# EAGLE design Adapter-IO4-35mm (EAGLE 7.7.0)
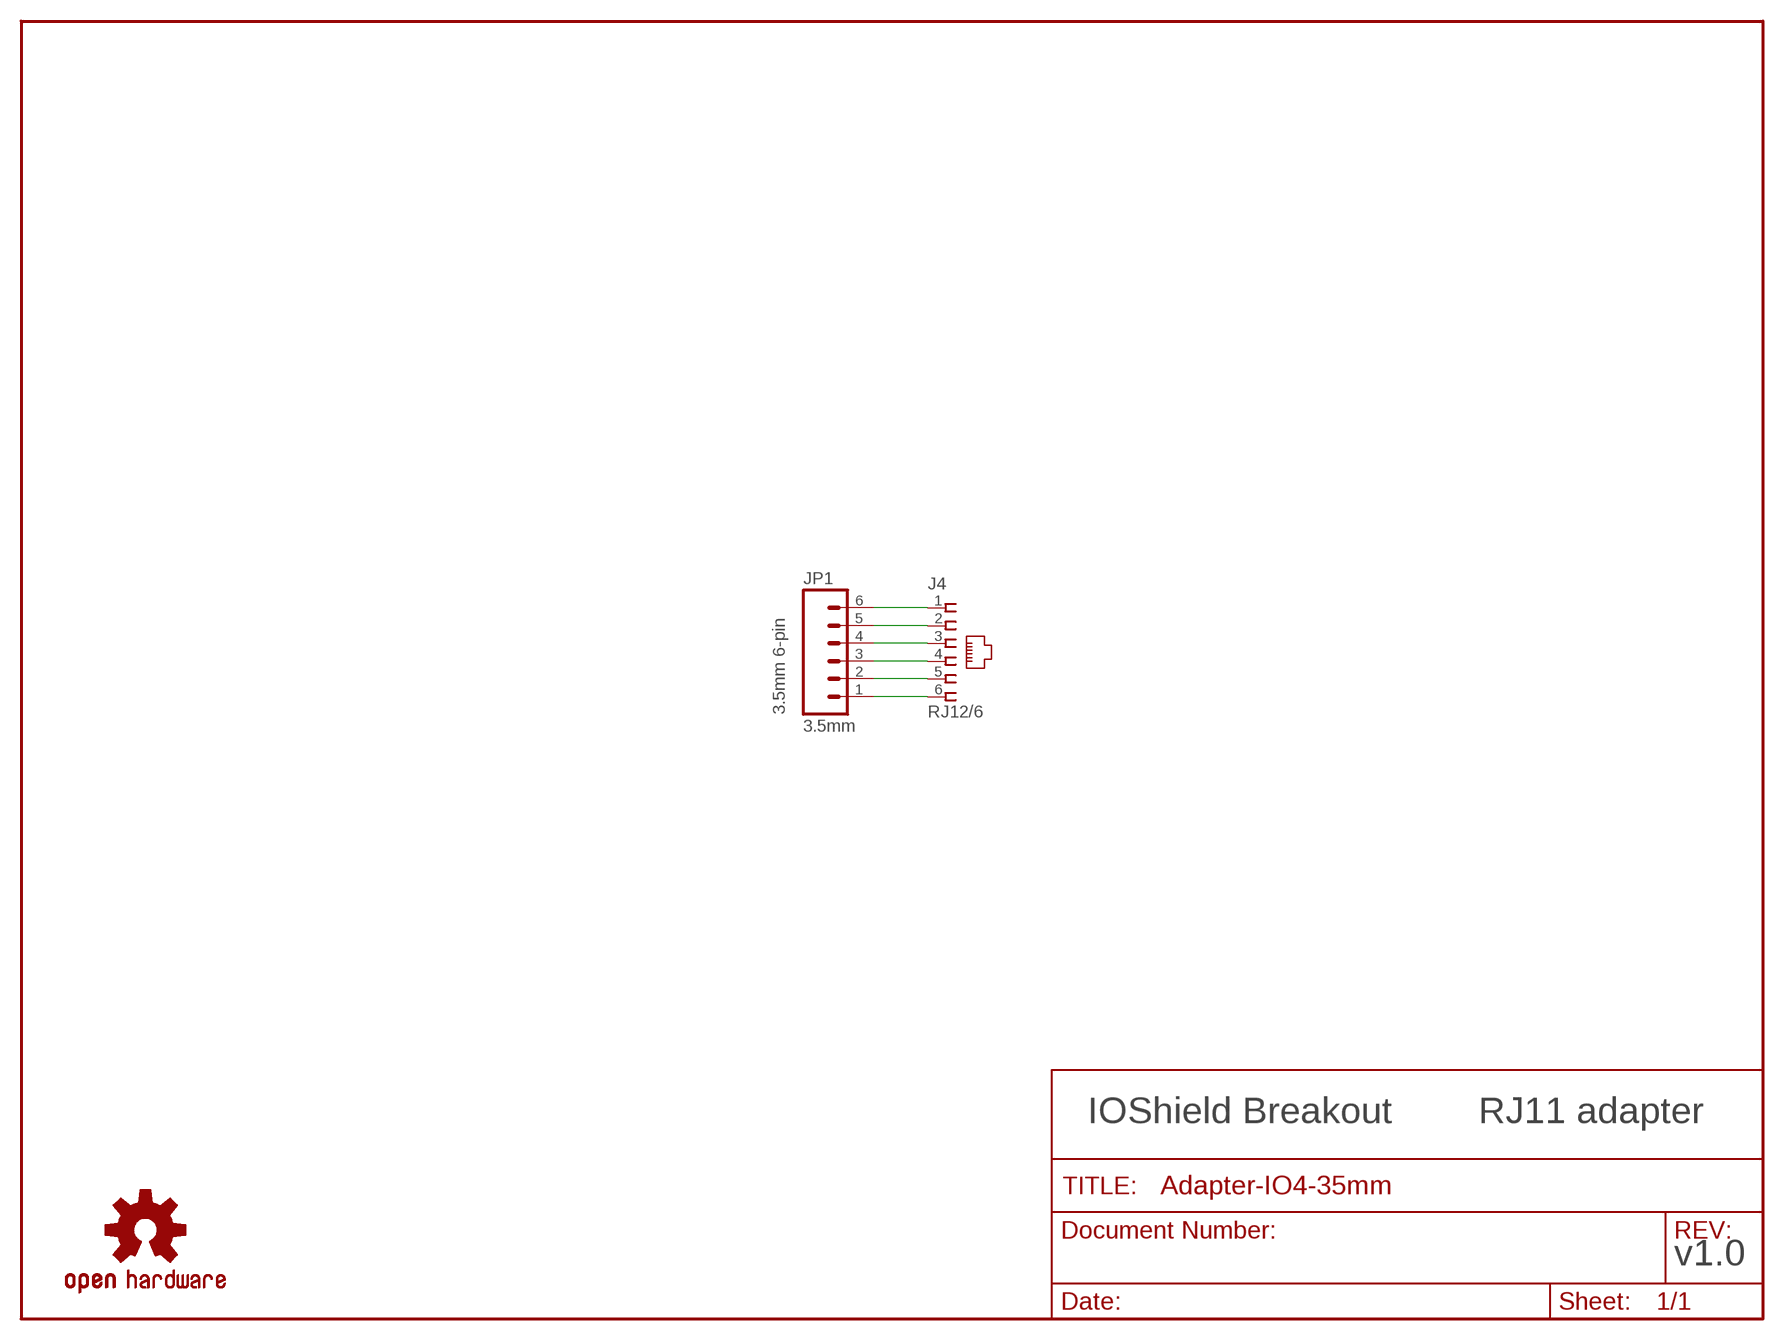
[diagram p0: schematic, sheet 1]

## Parts
J4  RJ12/6  CONNECTOR-RJ25-6P6C  [RJ25-PANEL]
JP1  3.5mm  CONNECTOR-M063.5MM-6  [SCREWTERMINAL-3.5MM-6]
U$1  OSHW  DOC-OSHW-LOGO-M  [OSHW-LOGO-M]

## Nets
GND: J4.6 JP1.1
IO1: J4.2 JP1.5
IO2: J4.3 JP1.4
IO3: J4.4 JP1.3
IO4: J4.5 JP1.2
VCC: J4.1 JP1.6

## Notes on the sheet
- 3.5mm 6-pin
- IOShield Breakout | RJ11 adapter
- v1.0

## Library data of the parts
J4 = SPCoast:CONNECTOR-RJ25: AMP connector; AMP: 520250-3; OPL: none
JP1 = SPCoast:CONNECTOR-M06: Header 6 Standard 6-pin 0.1" header
U$1 = SPCoast:DOC-OSHW-LOGO-: Open Source Hardware Logo This logo indicates the piece of hardware it is found on incorporates a OSHW license and/or adheres to the definition of open source hardware http://freedomdefined.org/OSHW Creative Commons - Attribution - ShareAlike 3.0

## Net classes
0 default: width 0.508 mm

## Board
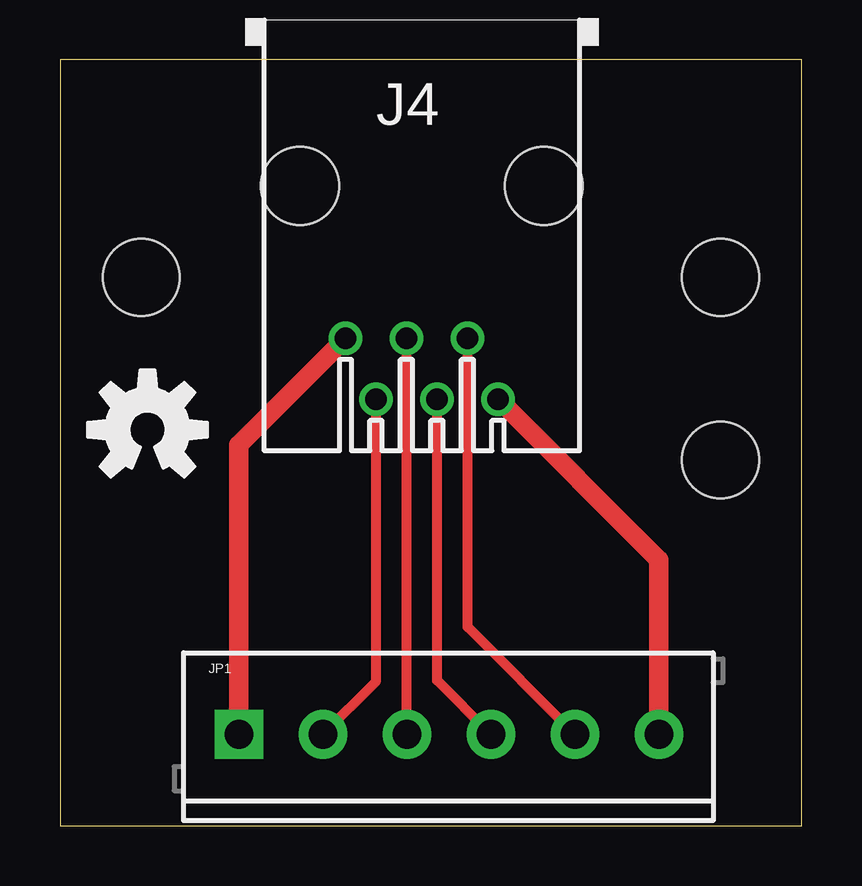
[diagram p1: board, top side]
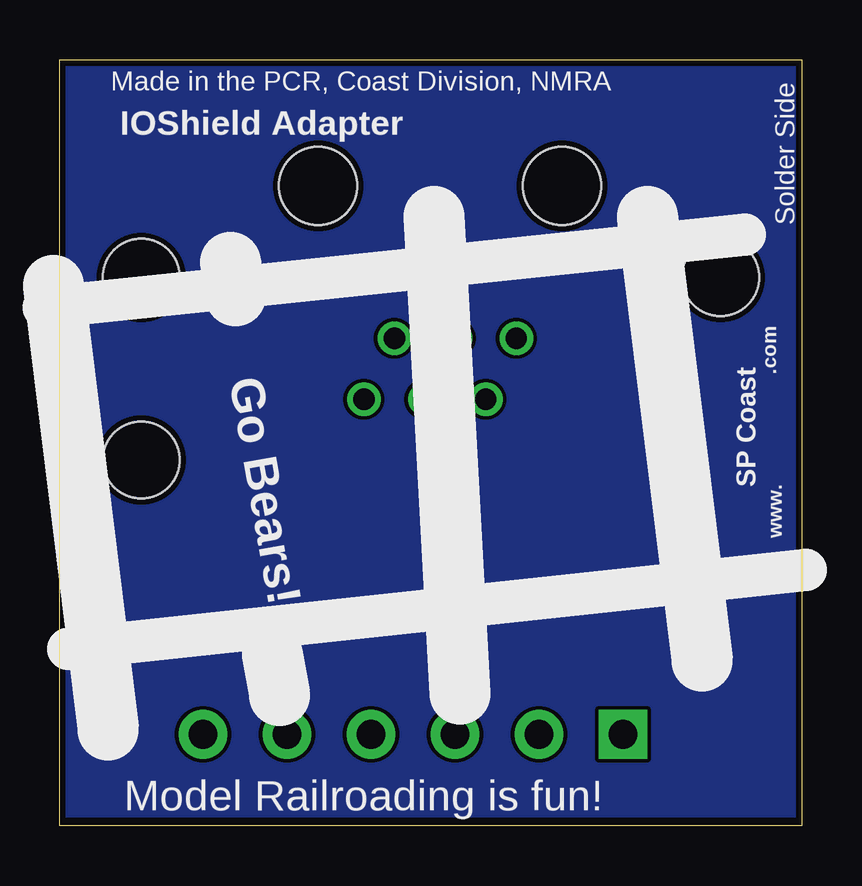
[diagram p2: board, bottom side, seen from below]

Size 30.91 x 31.92 mm. Coordinates in mm from the lower left corner, seen from the top.
Outline: 0,0 30.91,0 30.91,31.92 0,31.92 0,0
Copper layers (1*16): Top 0.035mm / dielectric 1.5mm / Bottom 0.035mm
Design rules "Fusion_eagle_rule_v1.1": minimum track width 6mil, minimum drill 12mil, track to track 6mil, track to pad 6mil, pad to pad 6mil, via to via 6mil, smd to smd 0mil, copper to edge 10mil, drill to drill 10mil, minimum pad ring 10mil, minimum via ring 6mil, stop-mask expansion 2mil, vias tented up to drill 100mil, thermal gap 10mil
Holes 3.2 mm at 3.39,22.86 27.52,22.86 27.52,15.23

### Footprints (pad centres in the part's own frame; a part is rotated, then mirrored left to right if it is on the bottom)
RJ25-PANEL = drill 0.889: 1 -3.175,8.89; 2 -1.905,6.35; 3 -0.635,8.89; 4 0.635,6.35; 5 1.905,8.89; 6 3.175,6.35 | hole 3.251: -5.08,0; 5.08,0
SCREWTERMINAL-3.5MM-6 = drill 1.2 pad 2.032 square: 1 0,0 | drill 1.2 pad 2.032: 2 3.5,0; 3 7,0; 4 10.5,0; 5 14,0; 6 17.5,0

### Placement (x,y rotation side)
J4  15.08,26.67 180 top
JP1  7.46,3.81 0 top
U$1  3.65,16.51 0 top

### Tracks (layer width: path | path; a pad name or v marks a point on that pad's centre or on a via)
GND
  Top 0.813: J4.6 7.46,15.87 JP1.1
IO1
  Top 0.406: J4.2 16.98,8.28 JP1.5
IO2
  Top 0.406: J4.3 15.71,6.05 JP1.4
IO3
  Top 0.406: J4.4 JP1.3
IO4
  Top 0.406: J4.5 13.17,6.02 JP1.2
N$1
  pour Bottom: 0.22,31.75 30.7,31.75 30.7,0.63 0.22,0.63
VCC
  Top 0.813: J4.1 24.96,11.07 JP1.6

### Text on the board
bNames: Solder Side | Made in the PCR, Coast Division, NMRA | IOShield Adapter | .com | SP Coast | www. | Go Bears! | Model Railroading is fun!
Document: SPCoast | v1.0 | Lines | 2011.10 | John Plocher | Open Source | Hardware | IOShield | Breakout | Gnd | 4 | 3 | 2 | 1 | V+